# EAGLE design MoleNet_v1 (EAGLE 7.5.0)
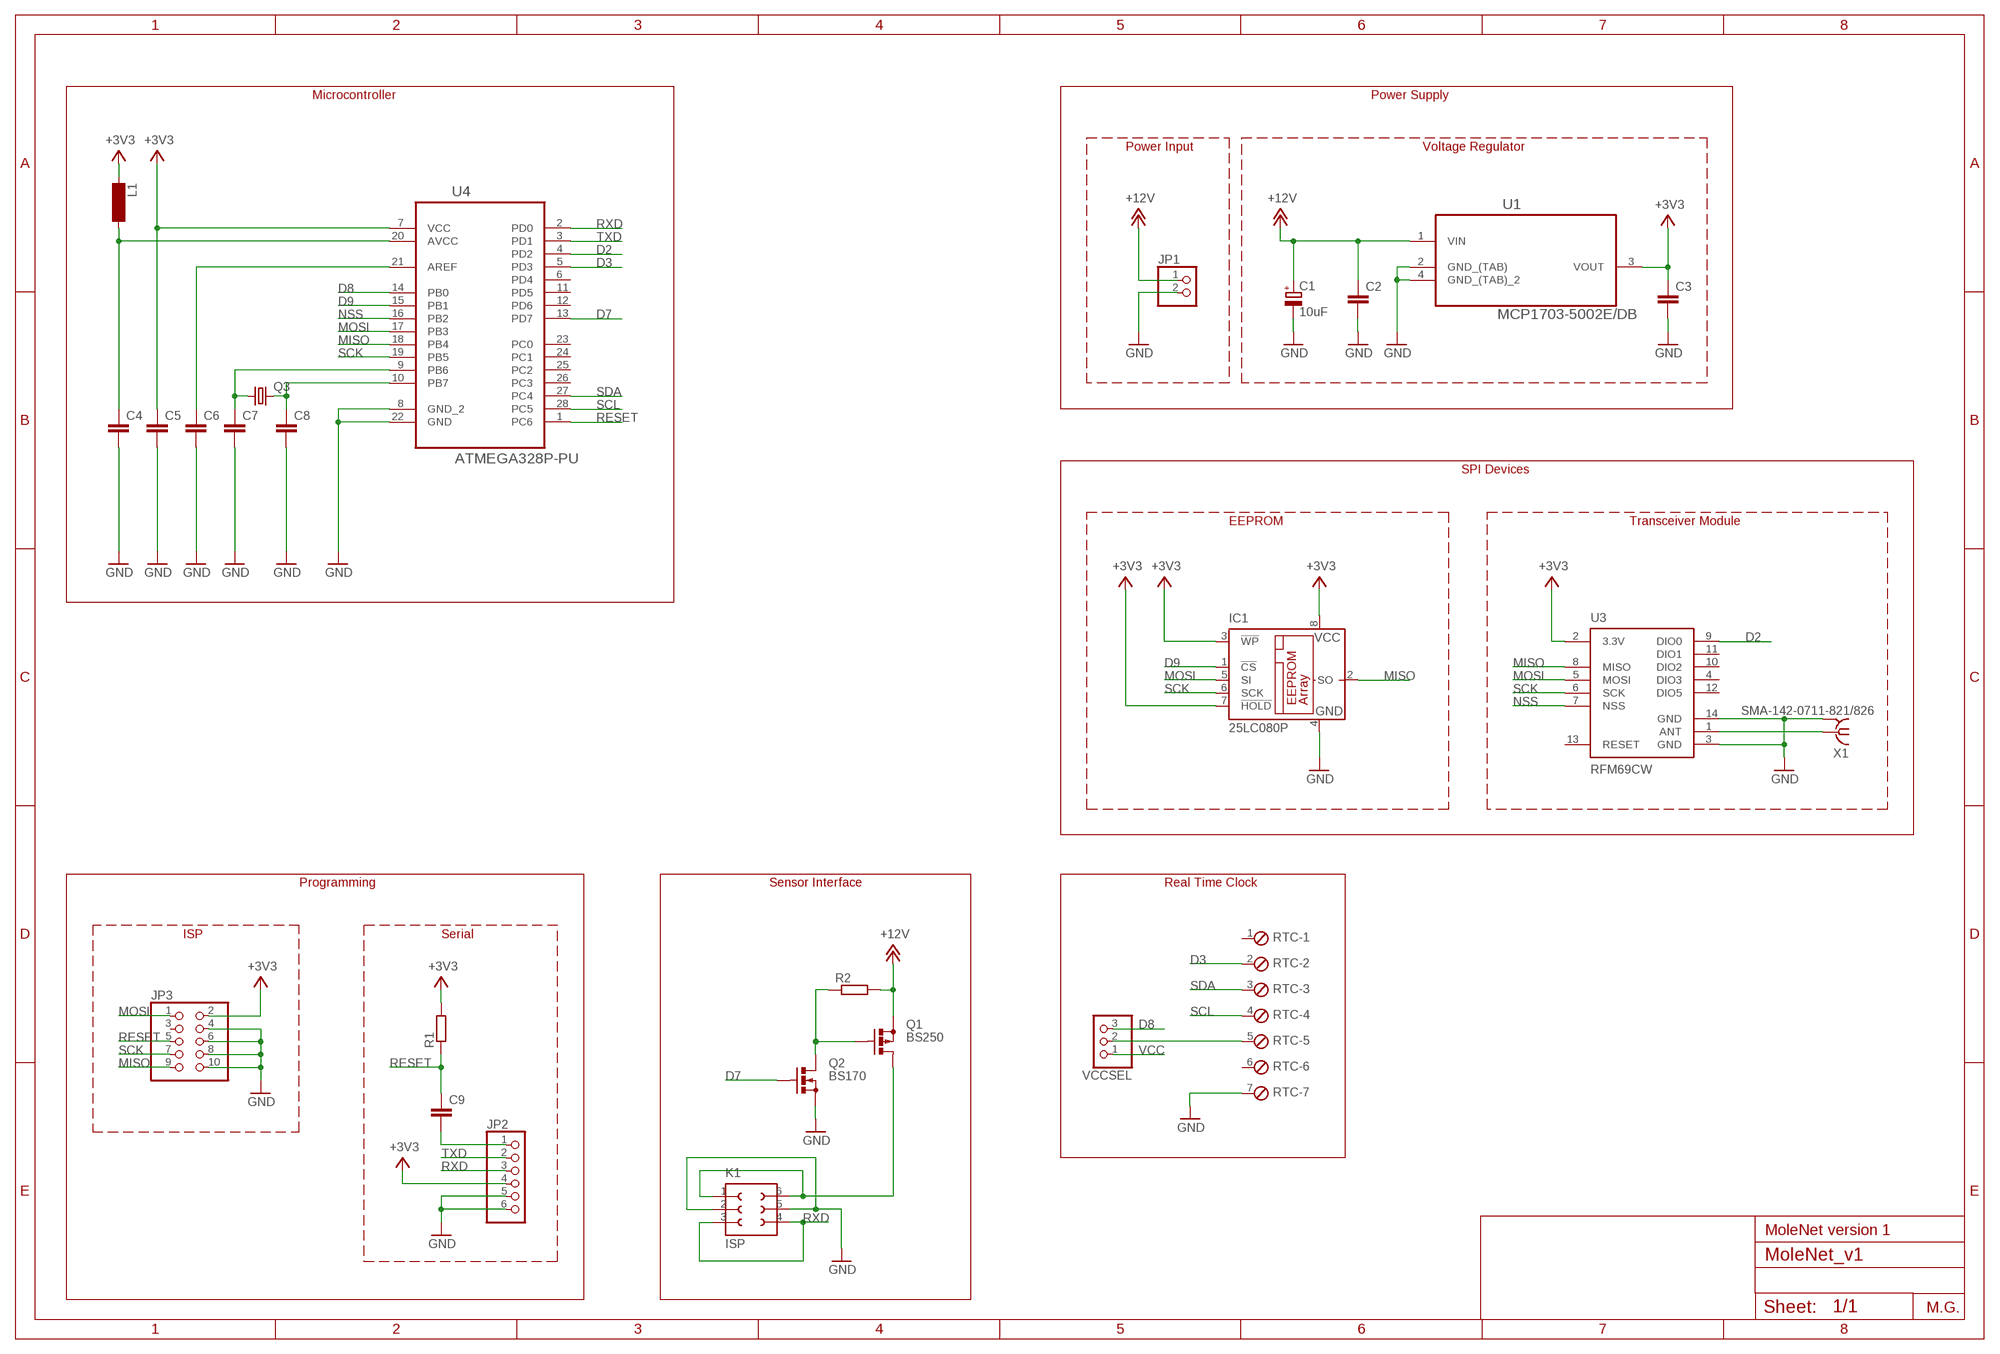
[diagram p0: schematic, sheet 1]

## Parts
C1  10uF  CPOL-EUE2.5-6  [E2,5-6]
C2  C-EU025-025X050  [C025-025X050]
C3  C-EU025-025X050  [C025-025X050]
C4  C-EU025-025X050  [C025-025X050]
C5  C-EU025-025X050  [C025-025X050]
C6  C-EU025-025X050  [C025-025X050]
C7  C-EU025-025X050  [C025-025X050]
C8  C-EU025-025X050  [C025-025X050]
C9  C-EU025-025X050  [C025-025X050]
IC1  25LC080P  [DIL8]
JP1  PINHD-1X2  [1X02]
JP2  PINHD-1X6  [1X06]
JP3  PINHD-2X5  [2X05]
K1  ISP  691411710003  [691411710003]
L1  BS11  [BS11]
Q1  BS250  [SOT54E]
Q2  BS170  [SOT54E]
Q3  CRYSTALHC18U-V  [HC18U-V]
R1  R-EU_0207/10  [0207/10]
R2  R-EU_0207/10  [0207/10]
RTC  MPT7  [7POL254]
U1  MCP1703-5002E/DB  [SOT230P700X180-4N]
U3  RFM69CW  [RFM69CW-XXXS2]
U4  ATMEGA328P-PU  [DIP254P762X457-28]
VCCSEL  PINHD-1X3  [1X03]
X1  SMA-142-0711-821/826  [J502-ND-142-0711-821/826]

## Nets
+12V: C1.+ C2.1 JP1.1 Q1.S R2.2 U1.1(VIN)
D2: U3.9(DIO0) U4.4(PD2)
D3: RTC.2 U4.5(PD3)
D7: Q2.G U4.13(PD7)
D8: U4.14(PB0) VCCSEL.3
D9: IC1.1(!CS) U4.15(PB1)
GND: C1.- C2.2 C3.2 C4.2 C5.2 C6.2 C7.2 C8.2 IC1.4(GND) JP1.2 JP2.5 JP2.6 JP3.4 JP3.6 JP3.8 JP3.10 K1.2 K1.5 Q2.S RTC.7 U1.2(GND_(TAB)) U1.4(GND_(TAB)_2) U3.3(GND) U3.14(GND) U4.8(GND_2) U4.22(GND) X1.G@1 X1.G@2 X1.G@3 X1.G@4
MISO: IC1.2(SO) JP3.9 U3.8(MISO) U4.18(PB4)
MOSI: IC1.5(SI) JP3.1 U3.5(MOSI) U4.17(PB3)
N$1: Q1.G Q2.D R2.1
N$2: K1.1 K1.6 Q1.D
N$3: C7.1 Q3.1 U4.9(PB6)
N$4: C8.1 Q3.2 U4.10(PB7)
N$5: C4.1 L1.2 U4.20(AVCC)
N$6: C6.1 U4.21(AREF)
N$9: C9.2 JP2.1
N$10: RTC.5 VCCSEL.2
N$15: U3.1(ANT) X1.1
NSS: U3.7(NSS) U4.16(PB2)
RESET: C9.1 JP3.5 R1.1 U4.1(PC6)
RXD: JP2.3 K1.3 K1.4 U4.2(PD0)
SCK: IC1.6(SCK) JP3.7 U3.6(SCK) U4.19(PB5)
SCL: RTC.4 U4.28(PC5)
SDA: RTC.3 U4.27(PC4)
TXD: JP2.2 U4.3(PD1)
VCC: C3.1 C5.1 IC1.3(!WP) IC1.7(!HOLD) IC1.8(VCC) JP2.4 JP3.2 L1.1 R1.2 U1.3(VOUT) U3.2(3.3V) U4.7(VCC) VCCSEL.1 ; supply symbol labelled +3V3
Unconnected: JP3.3 RTC.1 RTC.6 U3.4(DIO3) U3.10(DIO2) U3.11(DIO1) U3.12(DIO5) U3.13(RESET) U4.6(PD4) U4.11(PD5) U4.12(PD6) U4.23(PC0) U4.24(PC1) U4.25(PC2) U4.26(PC3)

## Notes on the sheet
- Microcontroller | Power Supply
- Power Input | Voltage Regulator
- SPI Devices
- EEPROM | Transceiver Module
- Programming | Sensor Interface | Real Time Clock
- ISP | Serial
- MoleNet version 1
- M.G.

## Library data of the parts
C1 = resistor:CPOL-EU: POLARIZED CAPACITOR, European symbol
C2-C9 = resistor:C-EU: CAPACITOR, European symbol
IC1 = microchip:25*: Serial EEPROM 4K/ 8K , SPI bus; MF: MICROCHIP; MPN: 25LC080/P; OC_FARNELL: 1556143; OC_NEWARK: 92C7440
JP1 = pinhead:PINHD-1X2: PIN HEADER
JP2 = pinhead:PINHD-1X6: PIN HEADER
JP3 = pinhead:PINHD-2X5: PIN HEADER
K1 = Terminal_Blocks_Connectors_rev15e:691411710003: WR-TBL Terminal block - serie 411 5,0mm - Spring clamp/Screw less - Horizontal entry - 03p Code:Con_TBL_Screwless_5.00_6914117100xxB_691411710003 <http://katalog.we-online.de/media/images/eican/Con_TBL_Screwless_5.00_6914117100xxB_pf2.jpg> Details see: http://katalog.we-online.de/en/em/691_411_710_0xx/691_411_710_003B?m Created 2014-12-22, aslant tao 2014 (C) Würth Elektronik
L1 = inductor-neosid:BS: INDUCTOR nominal inductance, magnetically screened; OC_FARNELL: unknown; OC_NEWARK: unknown
Q1 = transistor-small-signal:BS250: P-CHANNEL MOS FET
Q2 = transistor-small-signal:BS170: N-CHANNEL MOS FET
Q3 = crystal:CRYSTAL: CRYSTAL; OC_FARNELL: unknown; OC_NEWARK: unknown
R1 R2 = resistor:R-EU_: RESISTOR, European symbol
RTC = con-phoenix-254:MPT7: PHOENIX CONNECTOR; OC_FARNELL: unknown; OC_NEWARK: unknown
U1 = Microchip_By_element14_Batch_1:MCP1703-5002E/DB: IC, LDO REG, 250MA, 5V; MPN: MCP1703-5002E/DB; OC_FARNELL: 1627178; OC_NEWARK: 40M0624; PACKAGE: SOT-223-3; SUPPLIER: Microchip
U3 = SparkFun-RF:RFM69
U4 = Atmel_By_element14_Batch_1-00:ATMEGA328P-PU: 8-bit Microcontroller with In-System Programmable Flash; MPN: ATMEGA328P-PU; OC_FARNELL: 1715487; OC_NEWARK: 15R0268; PACKAGE: PDIP-28; SUPPLIER: Atmel
VCCSEL = pinhead:PINHD-1X3: PIN HEADER
X1 = con-coax:SMA-: SMA 50 Ohm End Launch Jack Receptacle - Round Contact Johnson Components Source: www.johnsoncomponents.com .. J502-ND.pdf; MF: JOHNSON COMPONENTS; MPN: 142-0711-821; OC_FARNELL: 1019328; OC_NEWARK: 16F3627

## Board
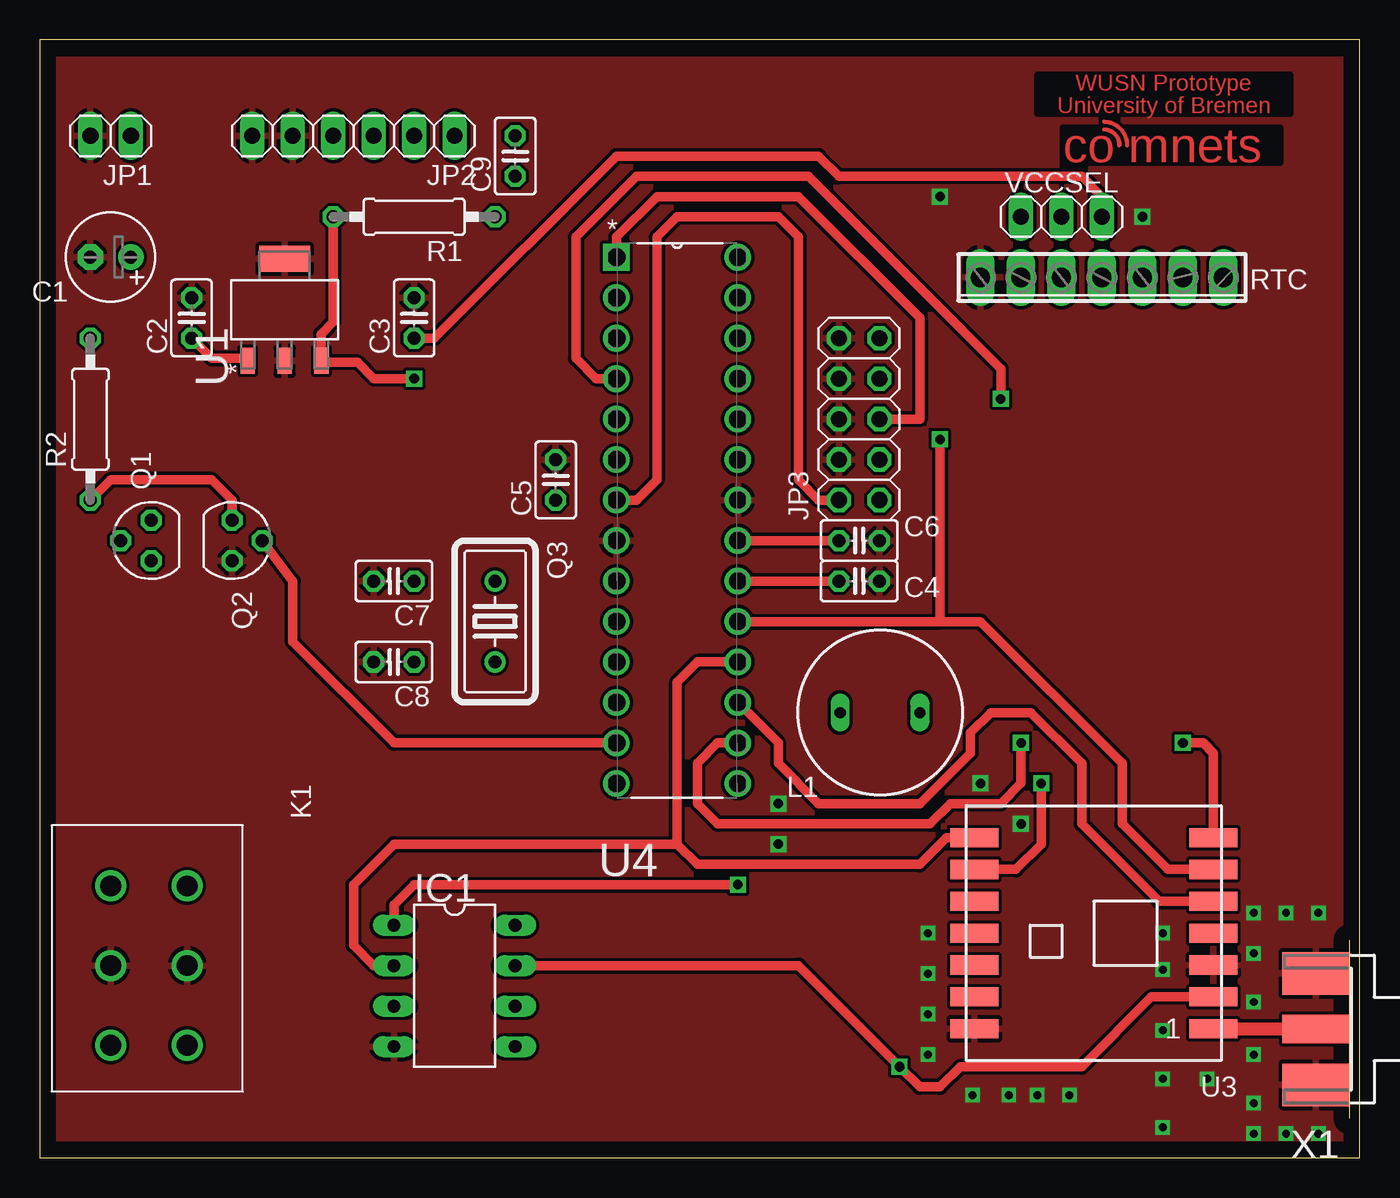
[diagram p1: board, top side]
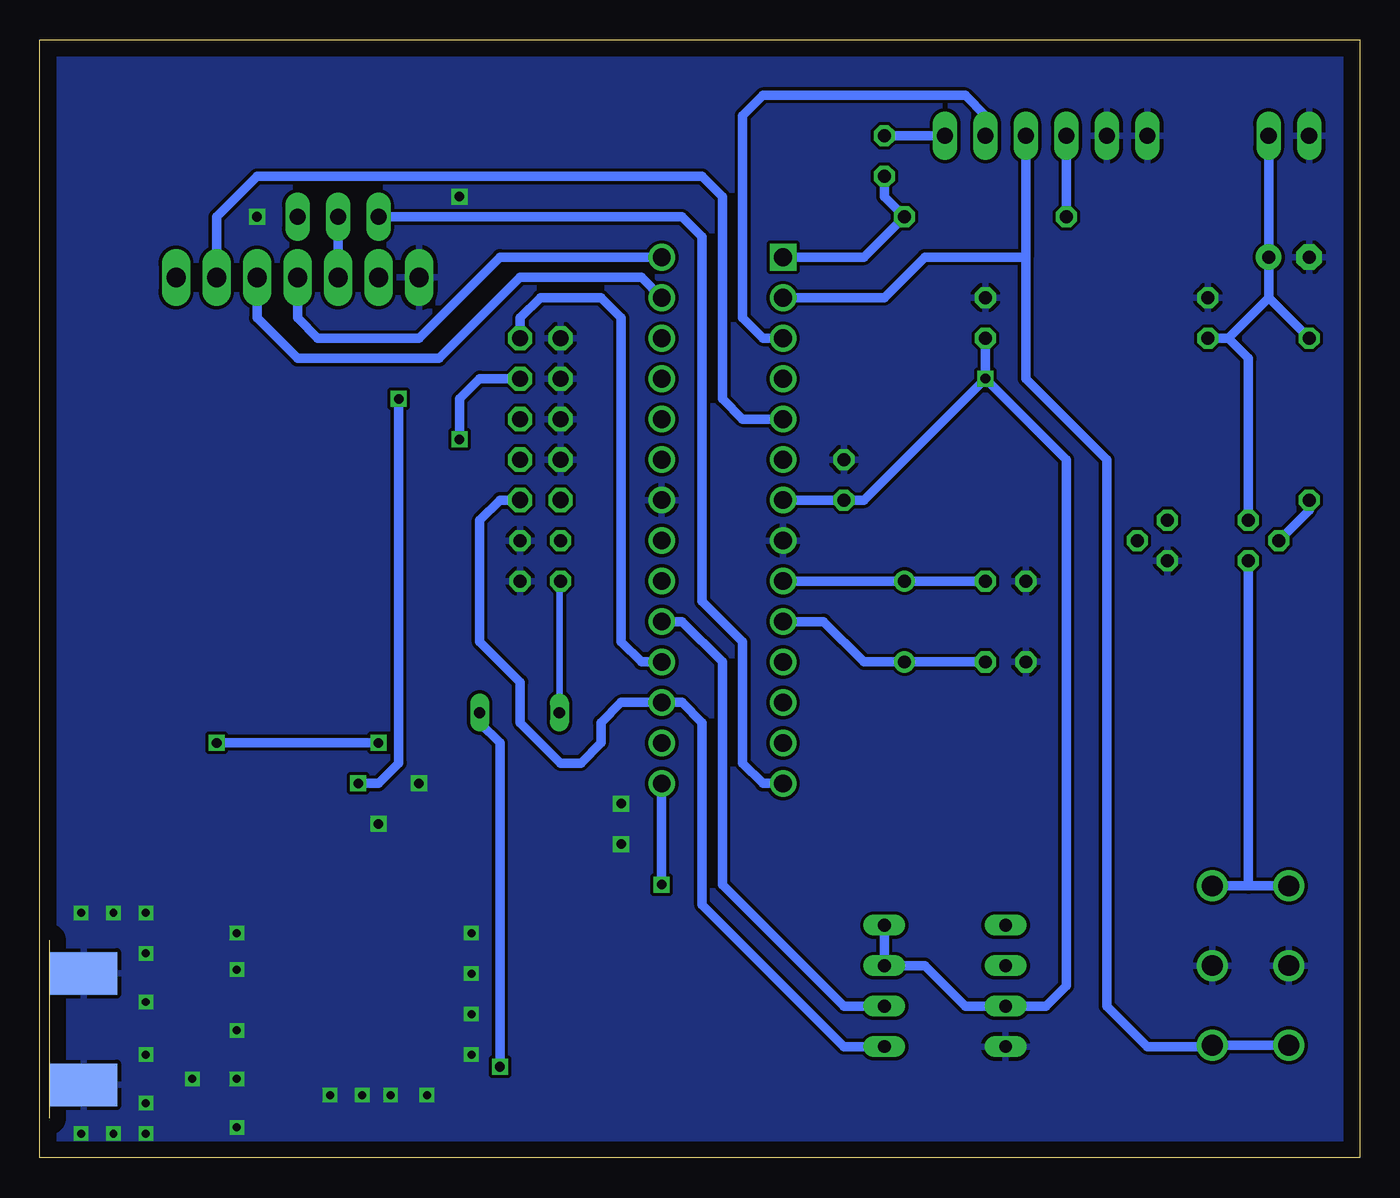
[diagram p2: board, bottom side, seen from below]

Size 82.85 x 70.16 mm. Coordinates in mm from the lower left corner, seen from the top.
Outline: 0,0 82.85,0 82.85,70.16 0,70.16 0,0
Copper layers (1*16): Top 0.035mm / dielectric 1.5mm / Bottom 0.035mm
Design rules "default": minimum track width 10mil, minimum drill 24mil, track to track 8mil, track to pad 8mil, pad to pad 8mil, via to via 8mil, smd to smd 8mil, copper to edge 40mil, drill to drill 8mil, minimum pad ring 10mil, minimum via ring 8mil, stop-mask expansion 4mil, vias tented up to drill 0mil, thermal gap 10mil

### Footprints (pad centres in the part's own frame; a part is rotated, then mirrored left to right if it is on the bottom)
E2,5-6 = drill 0.813 pad 1.6: + -1.27,0 | drill 0.813 pad 1.6 octagon: - 1.27,0
C025-025X050 = drill 0.813 octagon: 1 -1.27,0; 2 1.27,0
DIL8 = drill 0.813 long: 1 -3.81,-3.81; 2 -1.27,-3.81; 3 1.27,-3.81; 4 3.81,-3.81; 5 3.81,3.81; 6 1.27,3.81; 7 -1.27,3.81; 8 -3.81,3.81
1X02 = drill 1.016 long: 1 -1.27,0; 2 1.27,0
1X06 = drill 1.016 long: 1 -6.35,0; 2 -3.81,0; 3 -1.27,0; 4 1.27,0; 5 3.81,0; 6 6.35,0
2X05 = drill 1.016 octagon: 1 -5.08,-1.27; 2 -5.08,1.27; 3 -2.54,-1.27; 4 -2.54,1.27; 5 0,-1.27; 6 0,1.27; 7 2.54,-1.27; 8 2.54,1.27; 9 5.08,-1.27; 10 5.08,1.27
691411710003 = drill 1.3: 1 -5,0; 2 0,0; 3 5,0; 4 5,4.8; 5 0,4.8; 6 -5,4.8
BS11 = drill 0.7 long: 1 -2.5,0; 2 2.5,0
SOT54E = drill 0.813 octagon: D -1.27,0; G 0,1.905; S 1.27,0
HC18U-V = drill 0.813: 1 -2.54,0; 2 2.54,0
0207/10 = drill 0.813 octagon: 1 -5.08,0; 2 5.08,0
7POL254 = drill 1.2 long: 1 -7.62,0; 2 -5.08,0; 3 -2.54,0; 4 0,0; 5 2.54,0; 6 5.08,0; 7 7.62,0
SOT230P700X180-4N = smd 1.626 x 0.889: 1 -3.2,2.311; 2 -3.2,0; 3 -3.2,-2.311 | smd 1.626 x 3.175: 4 3.2,0
RFM69CW-XXXS2 = smd 3 x 1.2: 1 -7.5,6; 2 -7.5,4; 3 -7.5,2; 4 -7.5,0; 5 -7.5,-2; 6 -7.5,-4; 7 -7.5,-6; 8 7.5,-6; 9 7.5,-4; 10 7.5,-2; 11 7.5,0; 12 7.5,2; 13 7.5,4; 14 7.5,6
DIP254P762X457-28 = drill 1.118 square: 1 -7.62,33.02 | drill 1.118: 2 -7.62,30.48; 3 -7.62,27.94; 4 -7.62,25.4; 5 -7.62,22.86; 6 -7.62,20.32; 7 -7.62,17.78; 8 -7.62,15.24; 9 -7.62,12.7; 10 -7.62,10.16; 11 -7.62,7.62; 12 -7.62,5.08; 13 -7.62,2.54; 14 -7.62,0; 15 0,0; 16 0,2.54; 17 0,5.08; 18 0,7.62; 19 0,10.16; 20 0,12.7; 21 0,15.24; 22 0,17.78; 23 0,20.32; 24 0,22.86; 25 0,25.4; 26 0,27.94; 27 0,30.48; 28 0,33.02
1X03 = drill 1.016 long: 1 -2.54,0; 2 0,0; 3 2.54,0
J502-ND-142-0711-821/826 = smd 4.191 x 1.778: 1 2.115,0 | smd 4.191 x 2.667: G@1 2.115,3.495; G@2 2.115,-3.495 | smd 4.191 x 2.667 bottom: G@3 2.115,3.495; G@4 2.115,-3.495

### Placement (x,y rotation side)
C1  4.45,56.52 180 top
C2  9.53,52.7 90 top
C3  23.49,52.7 90 top
C4  51.44,36.2 0 top
C5  32.39,42.54 90 top
C6  51.44,38.74 0 top
C7  22.22,36.2 180 top
C8  22.22,31.12 180 top
C9  29.84,62.86 90 top
IC1  26.04,10.79 270 top
JP1  4.45,64.14 180 top
JP2  19.68,64.14 180 top
JP3  51.44,46.35 90 top
K1  4.45,12.06 270 top
L1  52.74,27.94 180 top
Q1  6.99,38.73 90 top
Q2  12.07,38.73 270 top
Q3  28.57,33.66 270 top
R1  23.49,59.05 180 top
R2  3.17,46.35 90 top
RTC  66.67,55.24 180 top
U1  15.37,53.21 90 top
U3  66.17,14.1 180 top
U4  43.82,23.5 0 top
VCCSEL  64.14,59.05 180 top
X1  82.22,8.08 180 top

### Tracks (layer width: path | path; a pad name or v marks a point on that pad's centre or on a via)
+12V
  Top 0.61: C2.1 10.79,50.16 12.9,50.16 U1.1
  Bottom 0.61: JP1.1 C1.+ 5.71,53.98 | 5.71,53.98 R2.2 | C2.1 8.26,51.43 | 8.26,51.43 5.71,53.98 | Q1.S 6.99,50.16 8.26,51.43
D2  (via drill 0.6)
  Top 0.61: v62.86,23.5 62.86,19.69 61.28,18.1 U3.9 | U4.4 34.93,48.89 33.65,50.16 33.65,57.78 37.47,61.59 48.26,61.59 60.33,49.53 v60.33,47.62
  Bottom 0.61: v62.86,23.5 61.6,23.5 60.33,24.77 v60.33,47.62
D3
  Bottom 0.61: RTC.2 71.76,59.05 69.21,61.59 41.28,61.59 40.01,60.32 40.01,47.62 38.73,46.35 U4.5
D7
  Top 0.61: U4.13 22.22,26.04 15.87,32.38 15.87,36.2 Q2.G
D8
  Bottom 0.61: VCCSEL.3 42.54,59.05 41.28,57.78 41.28,34.92 38.73,32.38 38.73,24.77 37.47,23.5 U4.14
D9  (via drill 0.6)
  Top 0.61: IC1.1 22.22,15.88 23.49,17.15 v43.82,17.15
  Bottom 0.61: v43.82,17.15 U4.15
GND  (via drill 0.5, 0.6)
  other vias: 80.26,15.37 78.23,15.37 76.2,15.37 76.2,12.83 76.2,9.78 76.2,6.48 76.2,3.43 78.23,1.52 80.26,1.52 73.28,4.95 70.48,14.1 70.48,11.81 70.48,8 70.48,4.95 55.75,14.1 55.75,11.56 55.75,9.02 55.75,6.48 58.55,3.94 60.83,3.94 62.61,3.94 64.64,3.94 76.2,1.52 70.48,1.91 61.6,20.96 59.05,23.5 69.21,59.05 46.36,22.23 46.36,19.69 56.52,60.32
  pour Top: 0.64,69.22 81.91,69.22 81.91,0.89 0.64,0.89
  pour Bottom: 0.64,69.22 81.91,69.22 81.91,0.89 0.64,0.89
MISO
  Top 0.61: U3.8 56.93,20.1 55.25,18.42 41.28,18.42 40.01,19.69 | U4.18 41.28,31.12 40.01,29.85 40.01,19.69 | IC1.2 20.95,12.06 19.68,13.33 19.68,17.15 22.22,19.69 40.01,19.69
  Bottom 0.61: U4.18 45.08,31.12 46.36,32.38 46.36,52.7 47.62,53.98 51.43,53.98 52.71,52.7 JP3.9
MOSI
  Top 0.61: U3.5 70.26,16.1 65.41,20.96 65.41,24.77 62.23,27.94 59.69,27.94 58.42,26.67 58.42,25.4 55.25,22.23 48.9,22.23 46.36,24.77 46.36,26.04 U4.17
  Bottom 0.61: IC1.5 32.39,6.98 41.28,15.88 41.28,27.31 42.54,28.58 U4.17 46.36,28.58 47.62,27.31 47.62,26.04 48.9,24.77 50.16,24.77 52.71,27.31 52.71,29.85 55.25,32.38 55.25,40 53.97,41.27 JP3.1
N$1
  Top 0.61: Q2.D 12.07,41.27 10.79,42.54 4.45,42.54 R2.1
  Bottom 0.61: R2.1 3.17,40.64 Q1.G
N$2
  Bottom 0.61: K1.1 6.99,17.07 | 6.99,17.07 K1.6 | Q1.D 6.99,17.07
N$3
  Bottom 0.61: U4.9 Q3.1 C7.1
N$4
  Bottom 0.61: C8.1 Q3.2 31.11,31.12 33.65,33.66 U4.10
N$5
  Top 0.61: C4.1 U4.20
  Bottom 0.406: 50.24,36.12 L1.2
  Bottom 0.61: 50.24,36.12 C4.1
N$6
  Top 0.61: C6.1 U4.21
N$7
  Top 0.254: 66.8,64.54 arc-90 67.77,63.52
N$8
  Top 0.254: 66.8,65.02 arc-90 68.25,63.52
N$9
  Bottom 0.61: C9.2 JP2.1
N$10
  Bottom 0.61: RTC.5 VCCSEL.2
N$15
  Top 0.61: 80.51,8.1 80.08,8.09 X1.1
  Top 0.813: U3.1 80.51,8.1
NSS  (via drill 0.6)
  Top 0.61: v71.76,26.04 73.02,26.04 73.67,25.39 U3.7 | v61.6,26.04 61.6,23.5 60.33,22.23 57.15,22.23 55.88,20.96 42.54,20.96 41.28,22.23 41.28,24.77 42.54,26.04 U4.16
  Bottom 0.61: v61.6,26.04 v71.76,26.04
RESET
  Top 0.61: U4.1 36.19,57.78 38.73,60.32 47.62,60.32 55.25,52.7 55.25,46.35 JP3.5
  Bottom 0.61: C9.1 29.84,60.32 R1.1 31.11,56.52 U4.1
RXD
  Bottom 0.61: 20.95,56.52 20.95,48.89 15.87,43.81 15.87,9.53 13.34,6.98 9.33,6.98 K1.4 K1.3 | 20.95,56.52 27.31,56.52 29.84,53.98 U4.2 | JP2.3 20.95,56.52
SCK  (via drill 0.6)
  Top 0.61: U4.19 56.51,33.66 | U3.6 70.8,18.1 67.94,20.96 67.94,24.77 59.05,33.66 56.51,33.66 | v56.51,45.09 56.51,33.66
  Bottom 0.61: U4.19 42.54,33.66 40.01,31.12 40.01,17.15 32.39,9.53 IC1.6 | v56.51,45.09 56.51,47.62 55.25,48.89 JP3.7
SCL
  Bottom 0.61: RTC.4 66.68,52.7 65.41,51.43 59.05,51.43 53.97,56.52 U4.28
SDA
  Bottom 0.61: RTC.3 69.21,52.7 66.68,50.16 57.79,50.16 52.71,55.24 45.08,55.24 U4.27
TXD
  Bottom 0.61: JP2.2 23.49,65.41 24.77,66.68 37.47,66.68 38.73,65.41 38.73,52.7 37.47,51.43 U4.3
VCC  (via drill 0.6)
  Top 0.61: v23.49,48.89 20.95,48.89 19.94,49.91 17.78,49.91 U1.3 17.65,50.04 17.65,51.69 18.42,52.45 R1.2 | U3.2 69.79,10.1 65.41,5.71 57.79,5.71 56.51,4.45 55.25,4.45 v53.97,5.71 47.62,12.06 IC1.7 | U4.7 37.47,41.27 38.73,42.54 38.73,57.78 40.01,59.05 46.36,59.05 47.62,57.78 47.62,42.54 48.9,41.27 JP3.2 | VCCSEL.1 66.68,60.32 65.41,61.59 50.16,61.59 48.9,62.86 36.19,62.86 24.77,51.43 C3.1
  Bottom 0.61: U4.7 C5.1 31.11,41.27 v23.49,48.89 | L1.1 55.25,27.31 53.97,26.04 v53.97,5.71 | JP2.4 R1.2 | C3.1 v23.49,48.89 | v23.49,48.89 18.42,43.81 18.42,10.79 19.68,9.53 IC1.3 24.77,9.53 27.31,12.06 IC1.7 IC1.8

### Text on the board
Top: WUSN Prototype / University of Bremen | co mnets